# Altium schematic sheet 02_BLOCK_DIAGRAM.SchDoc: =TitleParameter
size A3; Organization: ASISGUARD; Address1: Kemalpasa, Kemalpasa Cd. No:290 D:292H, 35060 Bornova/Izmir/Turkey
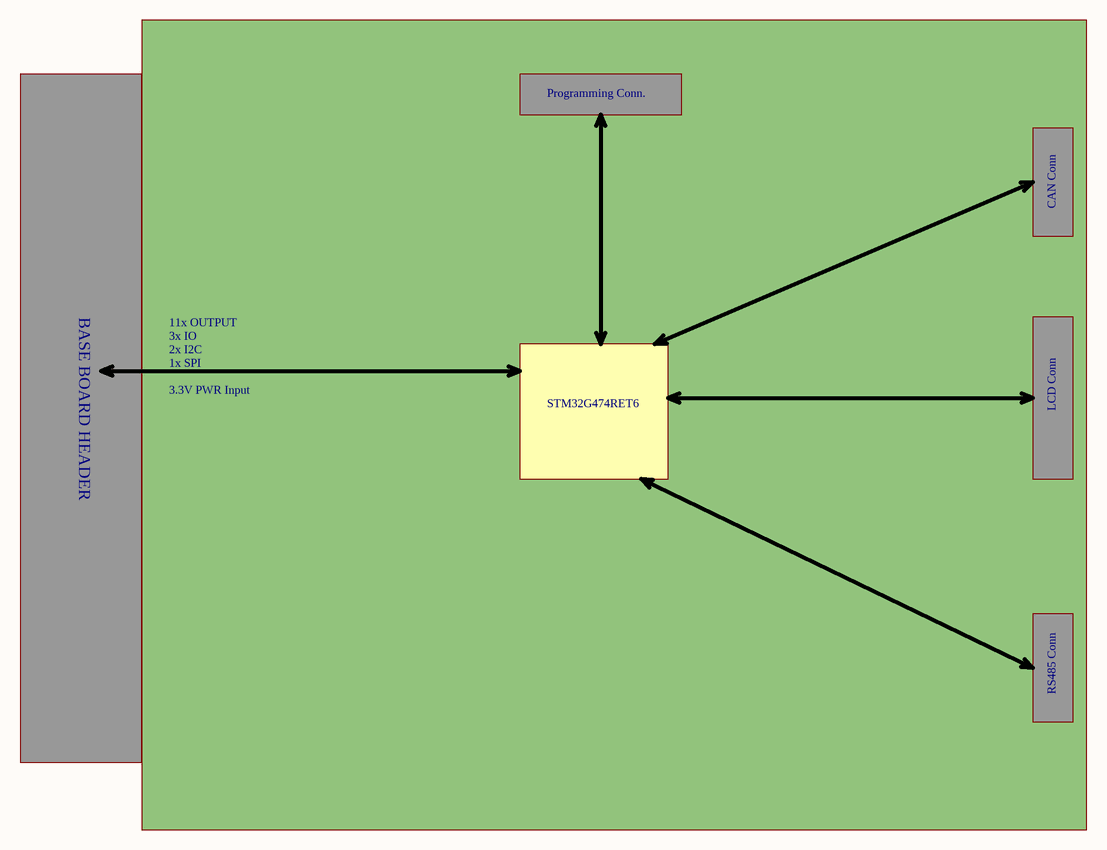
[diagram p0: 02_BLOCK_DIAGRAM.SchDoc]

## Notes on the sheet
- Programming Conn.
- CAN Conn
- BASE BOARD HEADER
- 11x OUTPUT
- 3x IO
- 2x I2C
- 1x SPI
- 3.3V PWR Input
- STM32G474RET6
- LCD Conn
- RS485 Conn
- Proje/Project:
- Sayfa Adı/Document Name:
- Çizilme Tarihi/Drawing Date
- Umit KAYACIK
- Tasarlayan/Designed By
- Sayfa/Sheet:
- Revision:
- of
- Son Güncelleme/Last Edit Date
- Kontrol eden/Checked By
- Onaylayan/Approved By
- Boyut/Size:
- Varyant/Variant:
- Dil/Language:
- A3
- ENG